# Altium project IO_Converter_Board.PrjPcb
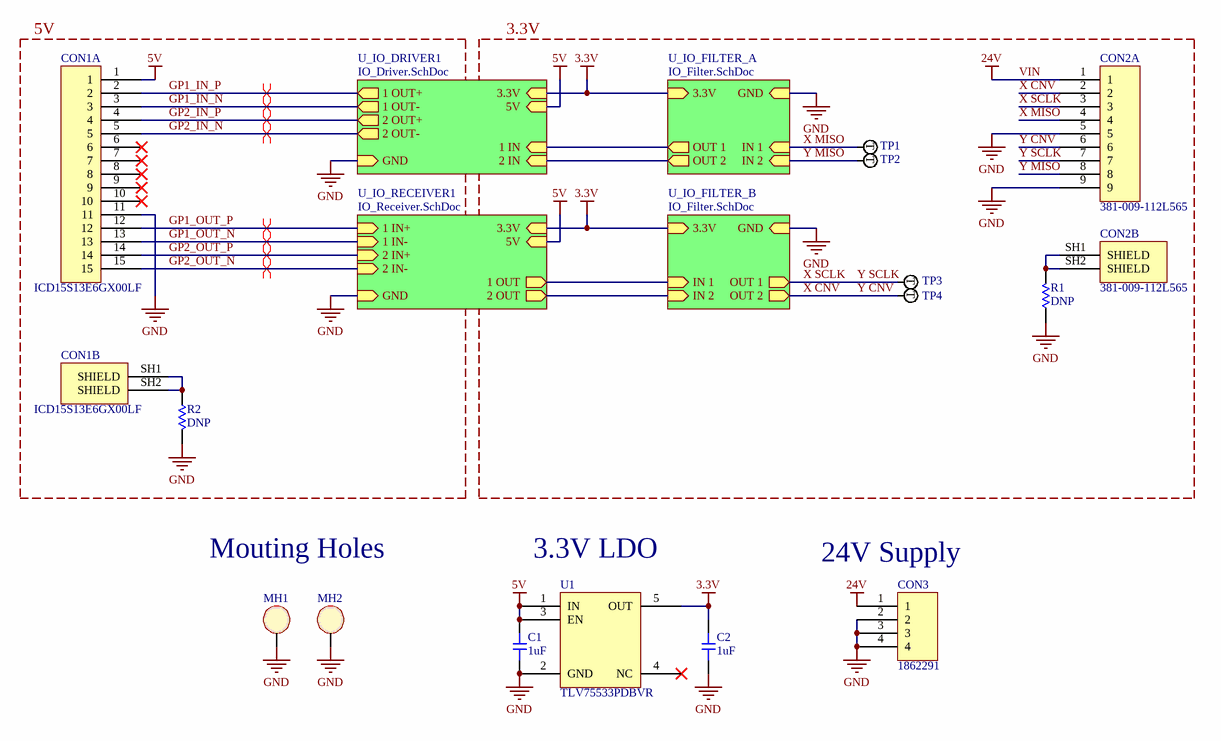
[diagram p0: IO_Converter.SchDoc]
ProjectGroup: Severson Group; ProjectOrganization: WEMPEC; ProjectRev: B; ProjectUniversity: UW - Madison
4 sheets, 94 parts. Net scope: hierarchical (ports join the sheet entries above them; power ports are global).
Board file: PCB.PcbDoc
Sheets:
  IO_Converter.SchDoc
    U_IO_FILTER_B = IO_Filter.SchDoc
    U_IO_FILTER_A = IO_Filter.SchDoc
    U_IO_DRIVER1 = IO_Driver.SchDoc
    U_IO_RECEIVER1 = IO_Receiver.SchDoc

## Sheet IO_Converter.SchDoc: IO Converter
size Letter; Engineer: Brandt Buchda; Revision: B; SheetNumber: 1; SheetTotal: 4

### Parts
C1  value 1uF  [0603-CAP]  (hidden comment: CL10A105KP8NNWC)
C2  value 1uF  [0603-CAP]  (hidden comment: CL10A105KP8NNWC)
CON1  ICD15S13E6GX00LF  [ICD15S13E6GX00LF]  (parts A,B of 2)
CON2  381-009-112L565  [381-009-112L565]  (parts A,B of 2)
CON3  1862291  [1862291]
MH1  MOUNT_HOLE  [MOUNTING_HOLE]  (value not drawn)  (no BOM)
MH2  MOUNT_HOLE  [MOUNTING_HOLE]  (value not drawn)  (no BOM)
R1  value DNP  [0603-RES]  (hidden comment: Resistor)  (no BOM)
R2  value DNP  [0603-RES]  (hidden comment: Resistor)  (no BOM)
TP1  RCU-0C  [RCU-0C]  (value not drawn)
TP2  RCU-0C  [RCU-0C]  (value not drawn)
TP3  RCU-0C  [RCU-0C]  (value not drawn)
TP4  RCU-0C  [RCU-0C]  (value not drawn)
U1  TLV75533PDBVR  [SOT95P280X145-5N]

### Blocks framed on the sheet
5V: CON1 R2
3.3V: CON2 R1 TP1-TP4

### Sub-sheets
U_IO_DRIVER1 = IO_Driver.SchDoc: 5V (in), 3.3V (in), GND (in), 1 IN (in), 2 IN (in), 1 OUT+ (out), 1 OUT- (out), 2 OUT+ (out), 2 OUT- (out)
U_IO_FILTER_A = IO_Filter.SchDoc: IN 1 (in), IN 2 (in), OUT 1 (out), OUT 2 (out), 3.3V (in), GND (in)
U_IO_FILTER_B = IO_Filter.SchDoc: IN 1 (in), IN 2 (in), OUT 1 (out), OUT 2 (out), 3.3V (in), GND (in)
U_IO_RECEIVER1 = IO_Receiver.SchDoc: 5V (in), 3.3V (in), GND (in), 1 OUT (out), 2 OUT (out), 1 IN+ (in), 1 IN- (in), 2 IN+ (in), 2 IN- (in)

### Nets
3.3V: C2.2 U1.5(OUT) ; sheet U_IO_FILTER_B/3.3V, sheet U_IO_FILTER_A/3.3V, sheet U_IO_DRIVER1/3.3V, sheet U_IO_RECEIVER1/3.3V
5V: C1.2 CON1.1 U1.1(IN) U1.3(EN) ; sheet U_IO_DRIVER1/5V, sheet U_IO_RECEIVER1/5V
GND: C1.1 C2.1 CON1.11 CON2.5 CON2.9 CON3.2 CON3.3 CON3.4 MH1.1 MH2.1 R1.2 R2.2 U1.2(GND) ; sheet U_IO_FILTER_B/GND, sheet U_IO_FILTER_A/GND, sheet U_IO_DRIVER1/GND, sheet U_IO_RECEIVER1/GND
VIN: CON2.1 CON3.1  [also labelled 24V]
GP1_IN_N: CON1.3 ; sheet U_IO_DRIVER1/1 OUT-
GP1_IN_P: CON1.2 ; sheet U_IO_DRIVER1/1 OUT+
GP1_OUT_N: CON1.13 ; sheet U_IO_RECEIVER1/1 IN-
GP1_OUT_P: CON1.12 ; sheet U_IO_RECEIVER1/1 IN+
GP2_IN_N: CON1.5 ; sheet U_IO_DRIVER1/2 OUT-
GP2_IN_P: CON1.4 ; sheet U_IO_DRIVER1/2 OUT+
GP2_OUT_N: CON1.15 ; sheet U_IO_RECEIVER1/2 IN-
GP2_OUT_P: CON1.14 ; sheet U_IO_RECEIVER1/2 IN+
X CNV: CON2.2 CON2.6 TP4.1 ; sheet U_IO_FILTER_B/OUT 2  [also labelled Y CNV]
X MISO: CON2.4 TP1.1 ; sheet U_IO_FILTER_A/IN 1
X SCLK: CON2.3 CON2.7 TP3.1 ; sheet U_IO_FILTER_B/OUT 1  [also labelled Y SCLK]
Y MISO: CON2.8 TP2.1 ; sheet U_IO_FILTER_A/IN 2
NetC4A_2: sheet U_IO_FILTER_A/OUT 1, sheet U_IO_DRIVER1/1 IN
NetC6A_2: sheet U_IO_FILTER_A/OUT 2, sheet U_IO_DRIVER1/2 IN
NetCON1_SH1: CON1.SH1(SHIELD) CON1.SH2(SHIELD) R2.1
NetCON2_SH1: CON2.SH1(SHIELD) CON2.SH2(SHIELD) R1.1
NetR3B_1: sheet U_IO_FILTER_B/IN 1, sheet U_IO_RECEIVER1/1 OUT
NetR5B_1: sheet U_IO_FILTER_B/IN 2, sheet U_IO_RECEIVER1/2 OUT

Not connected (* = marked no-connect by the designer): CON1 6* 7* 8* 9* 10*; U1 4(NC)*

### Layout directives
differential pair: GP1_IN_N, GP1_IN_P, GP1_OUT_N, GP1_OUT_P, GP2_IN_N, GP2_IN_P, GP2_OUT_N, GP2_OUT_P

### Notes on the sheet
- Mouting Holes
- (near U1) 3.3V LDO
- (near CON3) 24V Supply
- Title:
- File:
- Sheet:
- of
- Revision:
- Time:
- Date:
- Engineer:
- (in symbol Test Point) T

### Library data of the parts
C1 C2 = Capacitor 1uF: CAP CER 1UF 10V X5R 0603; Supplier 1: Digi-Key; Supplier Part Number 1: 1276-1863-1-ND
CON1 = ICD15S13E6GX00LF: 15 Position D-Sub, High Density Receptacle, Female Sockets Connector; Supplier Part Number 1: 609-2801-ND; Supplier 1: Digi-Key
CON2 = 381-009-112L565: 9 Position D-Type, Micro-D Plug, Male Pins Connector; Supplier 1: DigiKey; Supplier Part Number 1: NOR1136-ND
CON3 = 1862291: TERM BLOCK 4POS 45DEG 5MM PCB; Supplier 1: DigiKey; Supplier Part Number 1: 277-12141-ND
MH1 MH2 = MOUNT_HOLE: MOUNTING HOLE
R1 R2 = Resistor: DNP; Supplier 1: Digi-Key
TP1-TP4 = Test Point: PC TEST POINT NATURAL; Material - Insulation: No Insulation; Manufacturer Part Number: RCU-0C; Supplier Part Number: *; Supplier: *; Footprint: *; Supplier 1: Digi-Key; RoHS: RoHS Compliant; Category: Test and Measurement; Stock 1: 136646; Pricing 1: 1=0.22, 10=0.206, 25=0.1756, 50=0.1536, 100=0.1426, 250=0.12616, 500=0.12068, 1000=0.09874 (USD); Packaging: Cut Tape (CT); Part Status: Active; Type: PC Test Point; Mounting Type: Surface Mount; Color: Natural; Size / Dimension: 0.063" x 0.031" x 0.045" (1.60mm x 0.80mm x 1.15mm); Plating: -; Material - Body: -; ComponentLink1URL: http://www.te.com/commerce/DocumentDelivery/DDEController?Action=srchrtrv&DocNm=1773266&DocType=DS&DocLang=English; ComponentLink1Description: http://www.te.com/commerce/DocumentDelivery/DDEController?Action=srchrtrv&DocNm=1773266&DocType=DS&DocLang=English; Supplier Part Number 1: A106145CT-ND
U1 = TLV75533PDBVR: IC REG LINEAR 3.3V 500MA SOT23-5; Supplier 1: Digi-Key; Supplier Part Number 1: 296-50411-1-ND

## Sheet IO_Filter.SchDoc: IO Filter
size Letter; Engineer: Brandt Buchda; Revision: B; SheetNumber: 4; SheetTotal: 4
Used 2 times, as channels U_IO_FILTER_B, U_IO_FILTER_A. Parts and nets are listed once, with the designators drawn on the sheet.
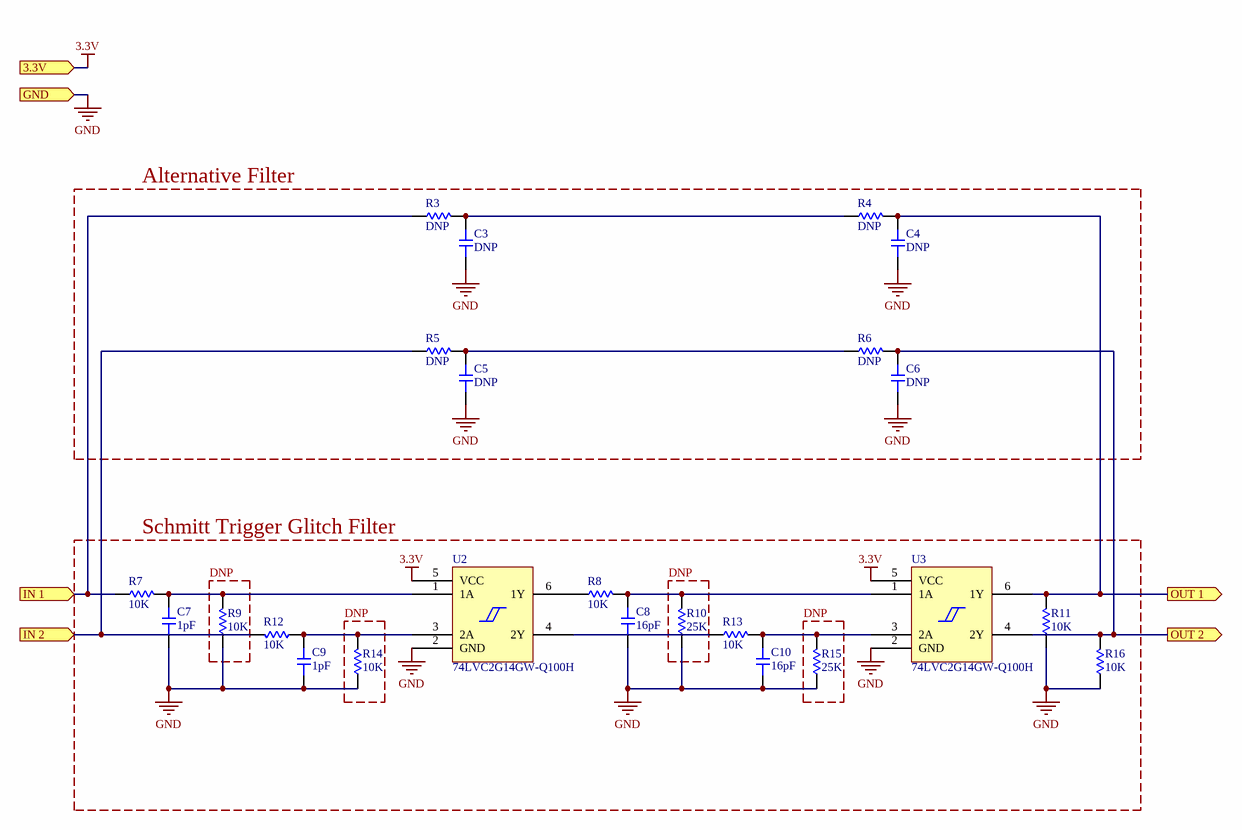
[diagram p1: IO_Filter.SchDoc]

### Parts
C3  DNP  [0603-CAP]  (no BOM)
C4  DNP  [0603-CAP]  (no BOM)
C5  DNP  [0603-CAP]  (no BOM)
C6  DNP  [0603-CAP]  (no BOM)
C7  value 1pF  [0603-CAP]  (hidden comment: CC0603BRNPO9BN1R0)
C8  value 16pF  [0603-CAP]  (hidden comment: CC0603JRNPO9BN160)
C9  value 1pF  [0603-CAP]  (hidden comment: CC0603BRNPO9BN1R0)
C10  value 16pF  [0603-CAP]  (hidden comment: CC0603JRNPO9BN160)
R3  DNP  [0603-RES]  (no BOM)
R4  DNP  [0603-RES]  (no BOM)
R5  DNP  [0603-RES]  (no BOM)
R6  DNP  [0603-RES]  (no BOM)
R7  value 10K  [0603-RES]  (hidden comment: RT0603DRE0710KL)
R8  value 10K  [0603-RES]  (hidden comment: RT0603DRE0710KL)
R9  value 10K  [0603-RES]  (hidden comment: RT0603DRE0710KL)
R10  value 25K  [RESC2012X06N]  (hidden comment: CPF-A-0805B25KE)
R11  value 10K  [0603-RES]  (hidden comment: RT0603DRE0710KL)
R12  value 10K  [0603-RES]  (hidden comment: RT0603DRE0710KL)
R13  value 10K  [0603-RES]  (hidden comment: RT0603DRE0710KL)
R14  value 10K  [0603-RES]  (hidden comment: RT0603DRE0710KL)
R15  value 25K  [RESC2012X06N]  (hidden comment: CPF-A-0805B25KE)
R16  value 10K  [0603-RES]  (hidden comment: RT0603DRE0710KL)
U2  74LVC2G14GW-Q100H  [TSOP65P210X110-6N]
U3  74LVC2G14GW-Q100H  [TSOP65P210X110-6N]

### Blocks framed on the sheet
Alternative Filter: C3-C6 R3-R6
Schmitt Trigger Glitch Filter: C7-C10 R7 R8 R11-R13 R16 U2 U3
DNP: R9
DNP: R10
DNP: R14
DNP: R15

### Ports
3.3V (in), GND (in), IN 1 (in), IN 2 (in), OUT 1 (out), OUT 2 (out)

### Nets
3.3V: U2.5(VCC) U3.5(VCC) ; port 3.3V
GND: C3.1 C4.1 C5.1 C6.1 C7.1 C8.1 C9.1 C10.1 R9.1 R10.1 R11.1 R14.1 R15.1 R16.1 U2.2(GND) U3.2(GND) ; port GND
IN 1: R3.1 R7.1 ; port IN 1
IN 2: R5.1 R12.2 ; port IN 2
OUT 1: C4.2 R4.2 R11.2 U3.6(1Y) ; port OUT 1
OUT 2: C6.2 R6.2 R16.2 U3.4(2Y) ; port OUT 2
NetC3_2: C3.2 R3.2 R4.1
NetC5_2: C5.2 R5.2 R6.1
NetC7_2: C7.2 R7.2 R9.2 U2.1(1A)
NetC8_2: C8.2 R8.2 R10.2 U3.1(1A)
NetC9_2: C9.2 R12.1 R14.2 U2.3(2A)
NetC10_2: C10.2 R13.2 R15.2 U3.3(2A)
NetR8_1: R8.1 U2.6(1Y)
NetR13_1: R13.1 U2.4(2Y)

### Channels
U_IO_FILTER_B: designators end in B; ports 3.3V=3.3V GND=GND IN 1=NetR3B_1 IN 2=NetR5B_1 OUT 1=X SCLK OUT 2=X CNV
U_IO_FILTER_A: designators end in A; ports 3.3V=3.3V GND=GND IN 1=X MISO IN 2=Y MISO OUT 1=NetC4A_2 OUT 2=NetC6A_2

### Notes on the sheet
- Title:
- File:
- Sheet:
- of
- Revision:
- Time:
- Date:
- Engineer:

### Library data of the parts
C3-C6 = Capacitor: Value: DNP
C7 C9 = Capacitor 1pF: ±0.1pF 50V Ceramic Capacitor C0G, NP0 0603 (1608 Metric); Supplier 1: DigiKey; Supplier Part Number 1: 311-3346-1-ND
C8 C10 = Capacitor 16pF: ±5% 50V Ceramic Capacitor C0G, NP0 0603 (1608 Metric); Supplier 1: DigiKey; Supplier Part Number 1: 311-3964-1-ND
R3-R6 = Resistor: Value: DNP
R7-R9 R11-R14 R16 = Resisitor 10K: 10 ±0.5% 0.1W, 1/10W Chip Resistor 0603 (1608 Metric) - Thin Film; Supplier Part Number 1: YAG2318CT-ND; Supplier 1: DigiKey
R10 R15 = Resistor 25K: 25 ±0.1% 0.1W, 1/10W Chip Resistor 0805 (2012 Metric) Anti-Sulfur, Automotive AEC-Q200, Moisture Resistant Thin Film; Supplier 1: DigiKey; Supplier Part Number 1: 1712-CPF-A-0805B25KECT-ND
U2 U3 = 74LVC2G14GW-Q100H: Inverter IC 2 Channel Schmitt Trigger SOT-363; Supplier 1: DigiKey; Supplier Part Number 1: 1727-2072-1-ND

## Sheet IO_Driver.SchDoc: IO Driver
size Letter; Engineer: Brandt Buchda; Revision: B; SheetNumber: 2; SheetTotal: 4
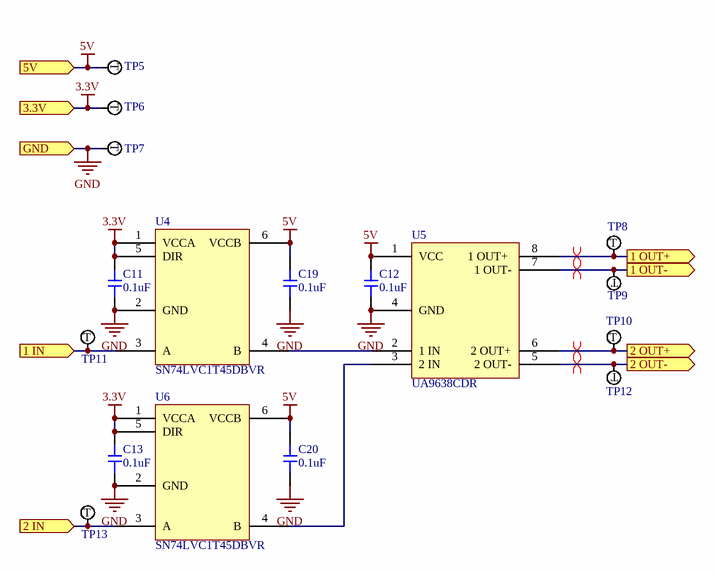
[diagram p2: IO_Driver.SchDoc]

### Parts
C11  value 0.1uF  [0603-CAP]  (hidden comment: CC0603KRX7R8BB104)
C12  value 0.1uF  [0603-CAP]  (hidden comment: CC0603KRX7R8BB104)
C13  value 0.1uF  [0603-CAP]  (hidden comment: CC0603KRX7R8BB104)
C19  value 0.1uF  [0603-CAP]  (hidden comment: CC0603KRX7R8BB104)
C20  value 0.1uF  [0603-CAP]  (hidden comment: CC0603KRX7R8BB104)
TP5  RCU-0C  [RCU-0C]  (value not drawn)
TP6  RCU-0C  [RCU-0C]  (value not drawn)
TP7  RCU-0C  [RCU-0C]  (value not drawn)
TP8  RCU-0C  [RCU-0C]  (value not drawn)
TP9  RCU-0C  [RCU-0C]  (value not drawn)
TP10  RCU-0C  [RCU-0C]  (value not drawn)
TP11  RCU-0C  [RCU-0C]  (value not drawn)
TP12  RCU-0C  [RCU-0C]  (value not drawn)
TP13  RCU-0C  [RCU-0C]  (value not drawn)
U4  SN74LVC1T45DBVR  [SOT95P280X145-6N]
U5  UA9638CDR  [SOIC127P600X175-8N]
U6  SN74LVC1T45DBVR  [SOT95P280X145-6N]

### Ports
1 IN (in), 1 OUT+ (out), 1 OUT- (out), 2 IN (in), 2 OUT+ (out), 2 OUT- (out), 3.3V (in), 5V (in), GND (in)

### Nets
3.3V: C11.2 C13.2 TP6.1 U4.1(VCCA) U4.5(DIR) U6.1(VCCA) U6.5(DIR) ; port 3.3V
5V: C12.2 C19.2 C20.2 TP5.1 U4.6(VCCB) U5.1(VCC) U6.6(VCCB) ; port 5V
GND: C11.1 C12.1 C13.1 C19.1 C20.1 TP7.1 U4.2(GND) U5.4(GND) U6.2(GND) ; port GND
GP1_IN_N: TP9.1 U5.7(1_OUT-) ; port 1 OUT-
GP1_IN_P: TP8.1 U5.8(1_OUT+) ; port 1 OUT+
GP2_IN_N: TP12.1 U5.5(2_OUT-) ; port 2 OUT-
GP2_IN_P: TP10.1 U5.6(2_OUT+) ; port 2 OUT+
NetC4A_2: TP11.1 U4.3(A) ; port 1 IN
NetC6A_2: TP13.1 U6.3(A) ; port 2 IN
NetU4_4: U4.4(B) U5.2(1_IN)
NetU5_3: U5.3(2_IN) U6.4(B)

### Layout directives
differential pair: GP1_IN_N, GP1_IN_P, GP2_IN_N, GP2_IN_P

### Notes on the sheet
- Title:
- File:
- Sheet:
- of
- Revision:
- Time:
- Date:
- Engineer:
- (in symbol Test Point) T

### Library data of the parts
C11-C13 C19 C20 = Capacitor 0.1uF: 0.1µF ±10% 25V Ceramic Capacitor X7R 0603 (1608 Metric); Supplier 1: Digi-Key; Supplier Part Number 1: 311-1341-1-ND
TP5-TP13 = Test Point: as TP1 on sheet IO_Converter; Manufacturer Part Number: RCU-0C; Supplier Part Number: *; Supplier: *; Footprint: *; Supplier 1: Digi-Key; RoHS: RoHS Compliant; Category: Test and Measurement; Stock 1: 136646; Pricing 1: 1=0.22, 10=0.206, 25=0.1756, 50=0.1536, 100=0.1426, 250=0.12616, 500=0.12068, 1000=0.09874 (USD); Packaging: Cut Tape (CT); Part Status: Active; Type: PC Test Point; Mounting Type: Surface Mount; Color: Natural; Size / Dimension: 0.063" x 0.031" x 0.045" (1.60mm x 0.80mm x 1.15mm); Plating: -; Material - Body: -; ComponentLink1URL: http://www.te.com/commerce/DocumentDelivery/DDEController?Action=srchrtrv&DocNm=1773266&DocType=DS&DocLang=English; ComponentLink1Description: http://www.te.com/commerce/DocumentDelivery/DDEController?Action=srchrtrv&DocNm=1773266&DocType=DS&DocLang=English; Supplier Part Number 1: A106145CT-ND
U4 U6 = SN74LVC1T45DBVR: IC TRNSLTR BIDIRECTIONAL SOT23-6; Supplier 1: Digi-Key; Supplier Part Number 1: 296-16843-1-ND
U5 = UA9638CDR: IC DRIVER 2/0 8SOIC; Supplier 1: DigiKey; Supplier Part Number 1: 296-15058-1-ND

## Sheet IO_Receiver.SchDoc: IO Receiver
size Letter; Engineer: Brandt Buchda; Revision: B; SheetNumber: 3; SheetTotal: 4
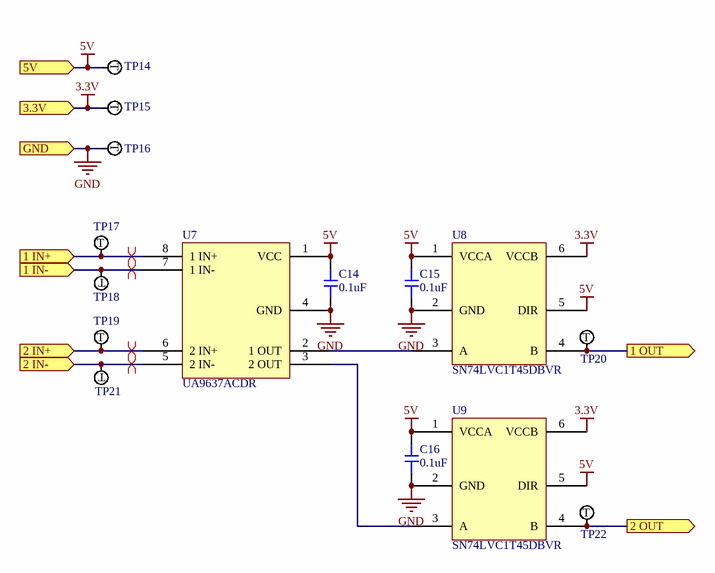
[diagram p3: IO_Receiver.SchDoc]

### Parts
C14  value 0.1uF  [0603-CAP]  (hidden comment: CC0603KRX7R8BB104)
C15  value 0.1uF  [0603-CAP]  (hidden comment: CC0603KRX7R8BB104)
C16  value 0.1uF  [0603-CAP]  (hidden comment: CC0603KRX7R8BB104)
TP14  RCU-0C  [RCU-0C]  (value not drawn)
TP15  RCU-0C  [RCU-0C]  (value not drawn)
TP16  RCU-0C  [RCU-0C]  (value not drawn)
TP17  RCU-0C  [RCU-0C]  (value not drawn)
TP18  RCU-0C  [RCU-0C]  (value not drawn)
TP19  RCU-0C  [RCU-0C]  (value not drawn)
TP20  RCU-0C  [RCU-0C]  (value not drawn)
TP21  RCU-0C  [RCU-0C]  (value not drawn)
TP22  RCU-0C  [RCU-0C]  (value not drawn)
U7  UA9637ACDR  [SOIC127P600X175-8N]
U8  SN74LVC1T45DBVR  [SOT95P280X145-6N]
U9  SN74LVC1T45DBVR  [SOT95P280X145-6N]

### Ports
1 IN+ (in), 1 IN- (in), 1 OUT (out), 2 IN+ (in), 2 IN- (in), 2 OUT (out), 3.3V (in), 5V (in), GND (in)

### Nets
3.3V: TP15.1 U8.6(VCCB) U9.6(VCCB) ; port 3.3V
5V: C14.2 C15.2 C16.2 TP14.1 U7.1(VCC) U8.1(VCCA) U8.5(DIR) U9.1(VCCA) U9.5(DIR) ; port 5V
GND: C14.1 C15.1 C16.1 TP16.1 U7.4(GND) U8.2(GND) U9.2(GND) ; port GND
GP1_OUT_N: TP18.1 U7.7(1_IN-) ; port 1 IN-
GP1_OUT_P: TP17.1 U7.8(1_IN+) ; port 1 IN+
GP2_OUT_N: TP21.1 U7.5(2_IN-) ; port 2 IN-
GP2_OUT_P: TP19.1 U7.6(2_IN+) ; port 2 IN+
NetR3B_1: TP20.1 U8.4(B) ; port 1 OUT
NetR5B_1: TP22.1 U9.4(B) ; port 2 OUT
NetU7_2: U7.2(1_OUT) U8.3(A)
NetU7_3: U7.3(2_OUT) U9.3(A)

### Layout directives
differential pair: GP1_OUT_N, GP1_OUT_P, GP2_OUT_N, GP2_OUT_P

### Notes on the sheet
- Title:
- File:
- Sheet:
- of
- Revision:
- Time:
- Date:
- Engineer:
- (in symbol Test Point) T

### Library data of the parts
C14-C16 = Capacitor 0.1uF: as C11 on sheet IO_Driver; Supplier 1: Digi-Key; Supplier Part Number 1: 311-1341-1-ND
TP14-TP22 = Test Point: as TP1 on sheet IO_Converter; Manufacturer Part Number: RCU-0C; Supplier Part Number: *; Supplier: *; Footprint: *; Supplier 1: Digi-Key; RoHS: RoHS Compliant; Category: Test and Measurement; Stock 1: 136646; Pricing 1: 1=0.22, 10=0.206, 25=0.1756, 50=0.1536, 100=0.1426, 250=0.12616, 500=0.12068, 1000=0.09874 (USD); Packaging: Cut Tape (CT); Part Status: Active; Type: PC Test Point; Mounting Type: Surface Mount; Color: Natural; Size / Dimension: 0.063" x 0.031" x 0.045" (1.60mm x 0.80mm x 1.15mm); Plating: -; Material - Body: -; ComponentLink1URL: http://www.te.com/commerce/DocumentDelivery/DDEController?Action=srchrtrv&DocNm=1773266&DocType=DS&DocLang=English; ComponentLink1Description: http://www.te.com/commerce/DocumentDelivery/DDEController?Action=srchrtrv&DocNm=1773266&DocType=DS&DocLang=English; Supplier Part Number 1: A106145CT-ND
U7 = UA9637ACDR: IC RECEIVER 0/2 8SOIC; Supplier 1: DigiKey; Supplier Part Number 1: 296-15056-1-ND
U8 U9 = SN74LVC1T45DBVR: IC TRNSLTR BIDIRECTIONAL SOT23-6; Supplier 1: Digi-Key; Supplier Part Number 1: 296-16843-1-ND

## Nets that join several sheets
3.3V: IO_Converter (C2.2 U1.5), U_IO_FILTER_B (U2B.5 U3B.5), U_IO_FILTER_A (U2A.5 U3A.5), IO_Driver (7 pins), IO_Receiver (TP15.1 U8.6 U9.6)
5V: IO_Converter (C1.2 CON1.1 U1.1 U1.3), IO_Driver (7 pins), IO_Receiver (9 pins)
GND: IO_Converter (13 pins), U_IO_FILTER_B (16 pins), U_IO_FILTER_A (16 pins), IO_Driver (9 pins), IO_Receiver (7 pins)
GP1_IN_N: IO_Converter (CON1.3), IO_Driver (TP9.1 U5.7)
GP1_IN_P: IO_Converter (CON1.2), IO_Driver (TP8.1 U5.8)
GP1_OUT_N: IO_Converter (CON1.13), IO_Receiver (TP18.1 U7.7)
GP1_OUT_P: IO_Converter (CON1.12), IO_Receiver (TP17.1 U7.8)
GP2_IN_N: IO_Converter (CON1.5), IO_Driver (TP12.1 U5.5)
GP2_IN_P: IO_Converter (CON1.4), IO_Driver (TP10.1 U5.6)
GP2_OUT_N: IO_Converter (CON1.15), IO_Receiver (TP21.1 U7.5)
GP2_OUT_P: IO_Converter (CON1.14), IO_Receiver (TP19.1 U7.6)
NetC4A_2: U_IO_FILTER_A (C4A.2 R4A.2 R11A.2 U3A.6), IO_Driver (TP11.1 U4.3)
NetC6A_2: U_IO_FILTER_A (C6A.2 R6A.2 R16A.2 U3A.4), IO_Driver (TP13.1 U6.3)
NetR3B_1: U_IO_FILTER_B (R3B.1 R7B.1), IO_Receiver (TP20.1 U8.4)
NetR5B_1: U_IO_FILTER_B (R5B.1 R12B.2), IO_Receiver (TP22.1 U9.4)
X CNV: IO_Converter (CON2.2 CON2.6 TP4.1), U_IO_FILTER_B (C6B.2 R6B.2 R16B.2 U3B.4)
X MISO: IO_Converter (CON2.4 TP1.1), U_IO_FILTER_A (R3A.1 R7A.1)
X SCLK: IO_Converter (CON2.3 CON2.7 TP3.1), U_IO_FILTER_B (C4B.2 R4B.2 R11B.2 U3B.6)
Y MISO: IO_Converter (CON2.8 TP2.1), U_IO_FILTER_A (R5A.1 R12A.2)